# Altium schematic sheet Wiring.schdoc
size 223 x 134 mm
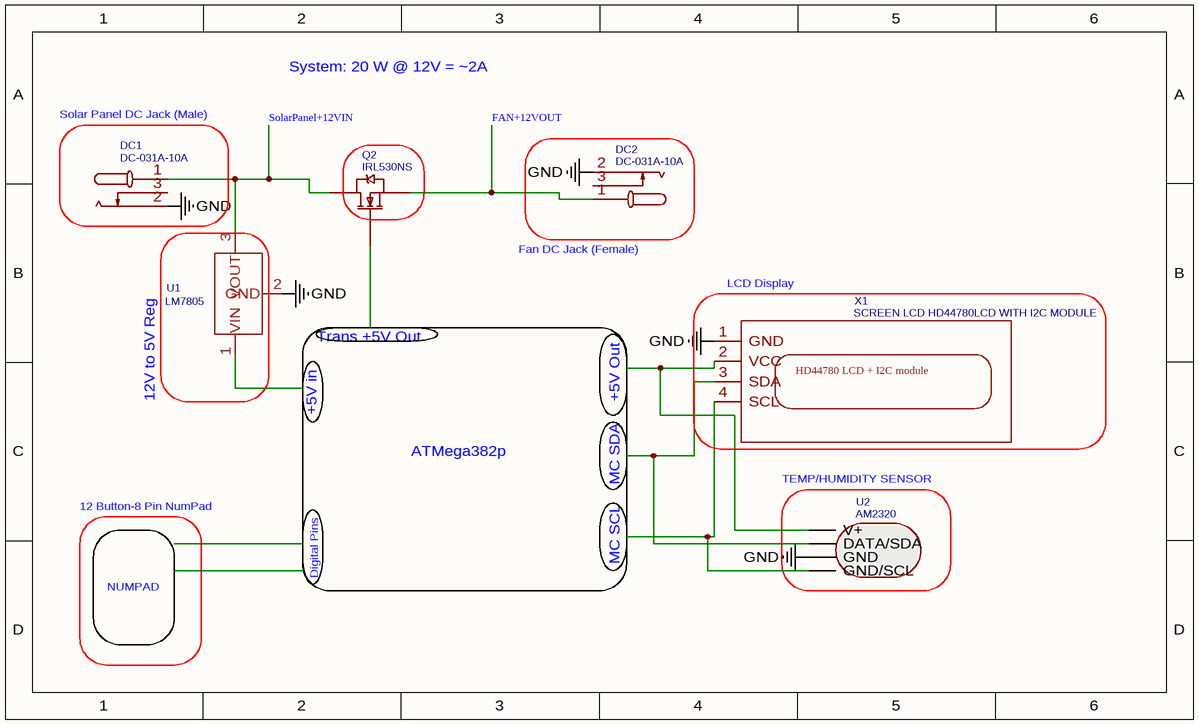
[diagram p0: Wiring.schdoc]

## Parts
DC1  DC-031A-10A  [DC-IN-SMD_DC-031A-10A]
DC2  DC-031A-10A  [DC-IN-SMD_DC-031A-10A]
Q2  IRL530NS  [D2PAK]
U1  LM7805  [SEEED-TO-220]
U2  AM2320  [AM2320]
X1  SCREEN LCD HD44780LCD WITH I2C MODULE  [LCD HD44780LCD WITH I2C MODULE]

## Blocks framed on the sheet
Solar Panel DC Jack (Male): DC1
12V to 5V Reg: U1
LCD Display: X1
TEMP/HUMIDITY SENSOR: U2

## Nets
GND: DC1.2 DC2.2 U1.2(GND) U2.3(GND) X1.1(GND)
FAN+12VOUT: DC2.1 Q2.3(S)
SolarPanel+12VIN: DC1.1 Q2.2(D) U1.3(VOUT)
NetU2_1: U2.1(V+) X1.2(VCC)
NetU2_2: U2.2(DATA/SDA) X1.3(SDA)
NetU2_4: U2.4(GND/SCL) X1.4(SCL)

Not connected (* = marked no-connect by the designer): DC1 3; DC2 3; Q2 1(G); U1 1(VIN)

## Notes on the sheet
- System: 20 W @ 12V = ~2A
- (near DC2) Fan DC Jack (Female)
- (near U1) Trans +5V Out
- +5V Out
- (near U1) +5V in
- ATMega382p
- MC SDA
- 12 Button-8 Pin NumPad
- Digital Pins
- MC SCL
- NUMPAD
- (in symbol SCREEN LCD HD44780LCD WITH I2C MODULE) HD44780 LCD + I2C module

## Library data of the parts
DC1 DC2 = DC-031A-10A: BOM_Manufacturer: HRO; Contributor: LCSC; BOM_Supplier: LCSC; BOM_Manufacturer Part: DC-031A-10A; BOM_Supplier Part: C145927; spicePre: D; spiceSymbolName: DC-031A-10A
U1 = LM7805: BOM_Manufacturer Part: LM7805ACT; sourceId: nNHZTbsmE; timeStamp: 1448003326; BOM_Supplier Part: 310030049; BOM_Supplier: SeeedStudio; spicePre: U; spiceSymbolName: LM7805ACT
U2 = AM2320: BOM_Manufacturer: EasyEDA; BOM_Manufacturer Part: Header-Male-2.54_1x4; BOM_EasyEDA: E59481; BOM_Supplier Part: E59481; BOM_Supplier: EasyEDA; spicePre: U; spiceSymbolName: AM2320
X1 = SCREEN LCD HD44780LCD WITH I2C MODULE: Contributor: dartagnan586e; spicePre: X; spiceSymbolName: SCREEN LCD HD44780LCD WITH I2C MODULE
Q2 = IRL530NS: spicePre: Q; spiceSymbolName: IRL530NS